# Altium project MazeBot.PrjPCB
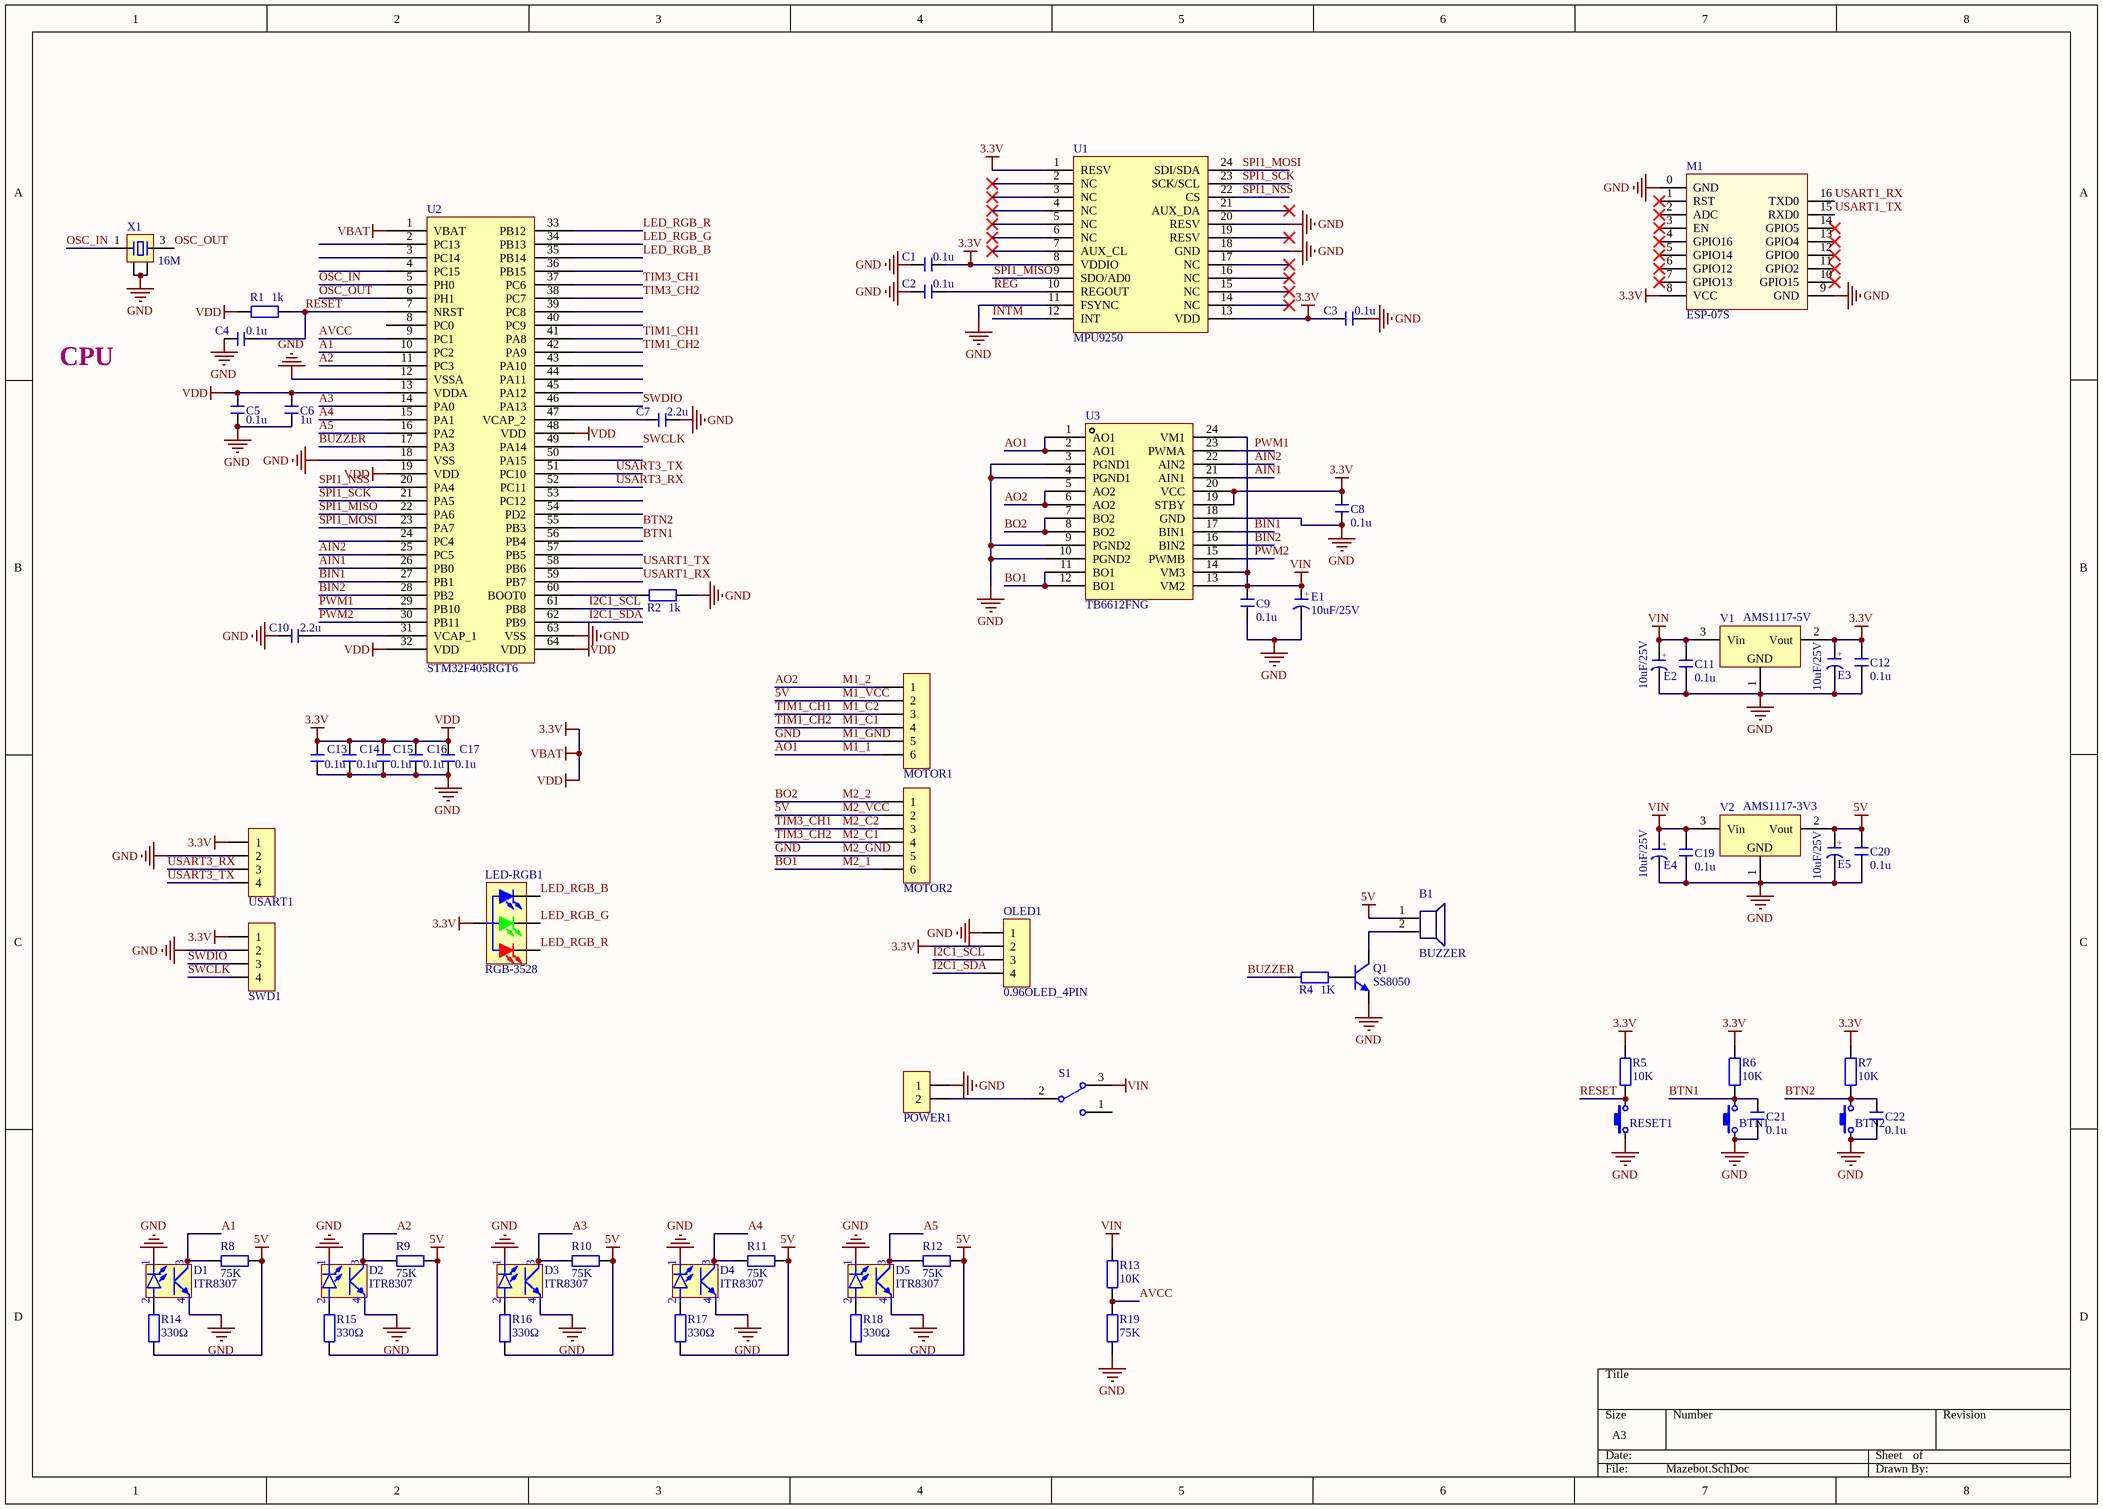
[diagram p0: Mazebot.SchDoc]
1 sheet, 69 parts. Net scope: global (net labels, ports and power ports of the same name join across sheets).
Board file: Mazebot.PcbDoc

## Sheet Mazebot.SchDoc
size A3

### Parts
B1  BUZZER  [BUZ-TH_BD9.0-P4.00-D1.0-FD]
BTN1  ButtonTACT_3x4x2_180  [ButtonTACT_3x4x2_180H]  (value not drawn)
BTN2  ButtonTACT_3x4x2_180  [ButtonTACT_3x4x2_180H]  (value not drawn)
C1  0.1u  [0603-CAP]
C2  0.1u  [0603-CAP]
C3  0.1u  [0603-CAP]
C4  0.1u  [0603-CAP]
C5  0.1u  [0603-CAP]
C6  1u  [0603-CAP]
C7  2.2u  [0603-CAP]
C8  0.1u  [0603-CAP]
C9  0.1u  [0603-CAP]
C10  2.2u  [0603-CAP]
C11  0.1u  [0603-CAP]
C12  0.1u  [0603-CAP]
C13  0.1u  [0603-CAP]
C14  0.1u  [0603-CAP]
C15  0.1u  [0603-CAP]
C16  0.1u  [0603-CAP]
C17  0.1u  [0603-CAP]
C19  0.1u  [0603-CAP]
C20  0.1u  [0603-CAP]
C21  0.1u  [0603-CAP]
C22  0.1u  [0603-CAP]
D1  ITR8307  [OPTO-SMD_ITR8307]
D2  ITR8307  [OPTO-SMD_ITR8307]
D3  ITR8307  [OPTO-SMD_ITR8307]
D4  ITR8307  [OPTO-SMD_ITR8307]
D5  ITR8307  [OPTO-SMD_ITR8307]
E1  10uF/25V  [3528-CAP]
E2  10uF/25V  [3528-CAP]
E3  10uF/25V  [3528-CAP]
E4  10uF/25V  [3528-CAP]
E5  10uF/25V  [3528-CAP]
LED-RGB1  RGB-3528  [LED 3528-4Pin]
M1  ESP-07S  [ESP-07S]
MOTOR1  HDR-1X6  [HDR2.54-M-LI-6P]  (value not drawn)
MOTOR2  HDR-1X6  [HDR2.54-M-LI-6P]  (value not drawn)
OLED1  0.96OLED_4PIN  [0.96OLED_4PIN]
POWER1  HDR-1X2  [XH2.54-LI-2P]  (value not drawn)
Q1  SS8050  [SOT23-3N]
R1  1k  [0603-RES]
R2  1k  [0603-RES]
R4  1K  [0603-RES]
R5  10K  [0603-RES]
R6  10K  [0603-RES]
R7  10K  [0603-RES]
R8  75K  [0603-RES]
R9  75K  [0603-RES]
R10  75K  [0603-RES]
R11  75K  [0603-RES]
R12  75K  [0603-RES]
R13  10K  [0603-RES]
R14  330Ω  [0603-RES]
R15  330Ω  [0603-RES]
R16  330Ω  [0603-RES]
R17  330Ω  [0603-RES]
R18  330Ω  [0603-RES]
R19  75K  [0603-RES]
RESET1  ButtonTACT_3x4x2_180  [ButtonTACT_3x4x2_180H]  (value not drawn)
S1  SwitchSPDT_4.3x8.6_D90  [SwitchSPDT_4.3X8.6_D90]  (value not drawn)
SWD1  HDR-1X4  [HDR2.54-LI-4P]  (value not drawn)
U1  MPU9250  [QFN_P0.4_24]
U2  STM32F405RGT6  [LQFP-64]
U3  TB6612FNG  [SSOP24_N]
USART1  HDR-1X4  [HDR2.54-LI-4P]  (value not drawn)
V1  AMS1117-5V  [SOT223_L]
V2  AMS1117-3V3  [SOT223_L]
X1  16M  [OSC 3225-4P]

### Nets
3.3V: C1.1 C3.2 C5.1 C6.1 C8.2 C12.2 C13.1 C14.1 C15.1 C16.1 C17.1 E3.1(A) LED-RGB1.4(A) M1.8(VCC) OLED1.2 R1.2 R5.1 R6.1 R7.1 SWD1.1 U1.1(RESV) U1.8(VDDIO) U1.13(VDD) U2.1(VBAT) U2.13(VDDA) U2.19(VDD) U2.32(VDD) U2.48(VDD) U2.64(VDD) U3.19(STBY) U3.20(VCC) USART1.1 V1.2(Vout)  [also labelled VBAT, VDD]
5V: B1.1(VCC) C20.2 E5.1(A) MOTOR1.2 MOTOR2.2 R8.1 R9.1 R10.1 R11.1 R12.1 R14.1 R15.1 R16.1 R17.1 R18.1 V2.2(Vout)  [also labelled M1_VCC, M2_VCC]
GND: BTN1.1 BTN2.1 C1.2 C2.2 C3.1 C4.2 C5.2 C6.2 C7.1 C8.1 C9.1 C10.2 C11.1 C12.1 C13.2 C14.2 C15.2 C16.2 C17.2 C19.1 C20.1 C21.1 C22.1 D1.1(K) D1.4(K) D2.1(K) D2.4(K) D3.1(K) D3.4(K) D4.1(K) D4.4(K) D5.1(K) D5.4(K) E1.2(K) E2.2(K) E3.2(K) E4.2(K) E5.2(K) M1.0(GND) M1.9(GND) MOTOR1.5 MOTOR2.5 OLED1.1 POWER1.1 Q1.2(E) R2.1 R19.2 RESET1.1 SWD1.2 U1.11(FSYNC) U1.18(GND) U1.20(RESV) U2.12(VSSA) U2.18(VSS) U2.63(VSS) U3.3(PGND1) U3.4(PGND1) U3.9(PGND2) U3.10(PGND2) U3.18(GND) USART1.2 V1.1(GND) V2.1(GND) X1.2 X1.4  [also labelled M1_GND, M2_GND]
VIN: C9.2 C11.2 C19.2 E1.1(A) E2.1(A) E4.1(A) R13.1 S1.3 U3.13(VM2) U3.14(VM3) U3.24(VM1) V1.3(Vin) V2.3(Vin)
A1: D1.3(K) R8.2 U2.10(PC2)
A2: D2.3(K) R9.2 U2.11(PC3)
A3: D3.3(K) R10.2 U2.14(PA0)
A4: D4.3(K) R11.2 U2.15(PA1)
A5: D5.3(K) R12.2 U2.16(PA2)
AIN1: U2.26(PB0) U3.21(AIN1)
AIN2: U2.25(PC5) U3.22(AIN2)
AO1: MOTOR1.6 U3.1(AO1) U3.2(AO1)  [also labelled M1_1]
AO2: MOTOR1.1 U3.5(AO2) U3.6(AO2)  [also labelled M1_2]
AVCC: R13.2 R19.1 U2.9(PC1)
BIN1: U2.27(PB1) U3.17(BIN1)
BIN2: U2.28(PB2) U3.16(BIN2)
BO1: MOTOR2.6 U3.11(BO1) U3.12(BO1)  [also labelled M2_1]
BO2: MOTOR2.1 U3.7(BO2) U3.8(BO2)  [also labelled M2_2]
BTN1: BTN1.2 C21.2 R6.2 U2.56(PB4)
BTN2: BTN2.2 C22.2 R7.2 U2.55(PB3)
BUZZER: R4.2 U2.17(PA3)
I2C1_SCL: OLED1.3 U2.61(PB8)
I2C1_SDA: OLED1.4 U2.62(PB9)
INTM: U1.12(INT)
LED_RGB_B: LED-RGB1.3(BULE_K) U2.35(PB14)
LED_RGB_G: LED-RGB1.2(GREEN_K) U2.34(PB13)
LED_RGB_R: LED-RGB1.1(RED_K) U2.33(PB12)
M1_C1: MOTOR1.4 U2.42(PA9)  [also labelled TIM1_CH2]
M1_C2: MOTOR1.3 U2.41(PA8)  [also labelled TIM1_CH1]
M2_C1: MOTOR2.4 U2.38(PC7)  [also labelled TIM3_CH2]
M2_C2: MOTOR2.3 U2.37(PC6)  [also labelled TIM3_CH1]
OSC_IN: U2.5(PH0) X1.1
OSC_OUT: U2.6(PH1) X1.3
PWM1: U2.29(PB10) U3.23(PWMA)
PWM2: U2.30(PB11) U3.15(PWMB)
REG: C2.1 U1.10(REGOUT)
RESET: C4.1 R1.1 R5.2 RESET1.2 U2.7(NRST)
SPI1_MISO: U1.9(SDO/AD0) U2.22(PA6)
SPI1_MOSI: U1.24(SDI/SDA) U2.23(PA7)
SPI1_NSS: U1.22(CS) U2.20(PA4)
SPI1_SCK: U1.23(SCK/SCL) U2.21(PA5)
SWCLK: SWD1.4 U2.49(PA14)
SWDIO: SWD1.3 U2.46(PA13)
USART1_RX: M1.16(TXD0) U2.59(PB7)
USART1_TX: M1.15(RXD0) U2.58(PB6)
USART3_RX: U2.52(PC11) USART1.3
USART3_TX: U2.51(PC10) USART1.4
NetB1_2: B1.2(GND) Q1.3(C)
NetC7_2: C7.2 U2.47(VCAP_2)
NetC10_1: C10.1 U2.31(VCAP_1)
NetD1_2: D1.2(A) R14.2
NetD2_2: D2.2(A) R15.2
NetD3_2: D3.2(A) R16.2
NetD4_2: D4.2(A) R17.2
NetD5_2: D5.2(A) R18.2
NetPOWER1_2: POWER1.2 S1.2
NetQ1_1: Q1.1(B) R4.1
NetR2_2: R2.2 U2.60(BOOT0)

Not connected (* = marked no-connect by the designer): M1 1(RST)* 2(ADC)* 3(EN)* 4(GPIO16)* 5(GPIO14)* 6(GPIO12)* 7(GPIO13)* 10(GPIO15)* 11(GPIO2)* 12(GPIO0)* 13(GPIO4)* 14(GPIO5)*; S1 1; U1 2(NC)* 3(NC)* 4(NC)* 5(NC)* 6(NC)* 7(AUX_CL)* 14(NC)* 15(NC)* 16(NC)* 17(NC)* 19(RESV)* 21(AUX_DA)*; U2 2(PC13) 3(PC14) 4(PC15) 8(PC0) 24(PC4) 36(PB15) 39(PC8) 40(PC9) 43(PA10) 44(PA11) 45(PA12) 50(PA15) 53(PC12) 54(PD2) 57(PB5)

### Notes on the sheet
- CPU
- (in symbol CT) +

### Library data of the parts
B1 = BUZZER: 小蜂鸣器 脚距4mm
BTN1 BTN2 RESET1 = ButtonTACT_3x4x2_180: Button
C1-C17 C19-C22 = C: 贴片电容; BOM名称: 无极性贴片电容; 淘宝ID: 封装库来自淘宝 ID：黄晶宝石; 联系售后，技术支持: https://shop463601444.taobao.com; 唯一出售店铺网址: https://shop463601444.taobao.com
D1-D5 = ITR8307: 反射式光电开关 收发一体
E1-E5 = CT: 贴片钽电容; 淘宝ID: 封装库来自淘宝 ID：黄晶宝石; BOM名称: 贴片钽电容; 联系售后: https://shop463601444.taobao.com
LED-RGB1 = LED-RGB 3528: 3528三基色LED; BOM名称: 三基色LED; 版权归属: 封装库来自淘宝 ID：黄晶宝石; 封装库来自淘宝卖家 ID：黄晶宝石: 其他店铺购入均为盗版，不享受售后技术支持服务，请立即申请退款; 学习资源: https://shop463601444.taobao.com
MOTOR1 MOTOR2 = Header 6: 6P接插件; 版权归属: 封装库来自淘宝 ID：黄晶宝石; BOM名称: 6P接插件; 学习资源: https://shop463601444.taobao.com
POWER1 = Header 2: 2P接插件; 版权归属: 封装库来自淘宝 ID：黄晶宝石; BOM名称: 2P接插件; 联系售后: https://shop463601444.taobao.com
Q1 = 8050-SMD: 高频放大-NPN型; 版权归属: 封装库来自淘宝 ID：黄晶宝石; 属性: 40V 1.5A 1W 100MHZ; BOM名称: 高频放大-NPN型; 联系售后: https://shop463601444.taobao.com
R1 R2 R4-R19 = R: 贴片电阻; 版权归属: 来自淘宝 ID：黄晶宝石; 封装库来自淘宝卖家 ID：黄晶宝石: 其他店铺购入均为盗版，不享受售后技术支持服务，请立即申请退款; BOM名称: 贴片电阻; 联系售后: https://shop463601444.taobao.com
S1 = SwitchSPDT_4.3x8.6_D90: Switch
SWD1 USART1 = Header 4: 4P接插件; 版权归属: 封装库来自淘宝 ID：黄晶宝石; BOM名称: 4P接插件; 学习资源: https://shop463601444.taobao.com
U1 = MPU925x: 9轴姿态传感器
U2 = STM32F405RGT7
U3 = TB6612FNG: 双直流电机驱动器
V1 V2 = AMS1117: 三端稳压芯片; BOM名称: 稳压芯片; 淘宝ID: 封装库来自淘宝 ID：黄晶宝石; 欢迎光临淘宝店铺: https://shop463601444.taobao.com
X1 = XTAL-4P: 4脚无源晶振; 版权归属: 封装库来自淘宝卖家 ID：黄晶宝石; BOM名称: 4脚无源晶振; 学习资源: https://shop463601444.taobao.com